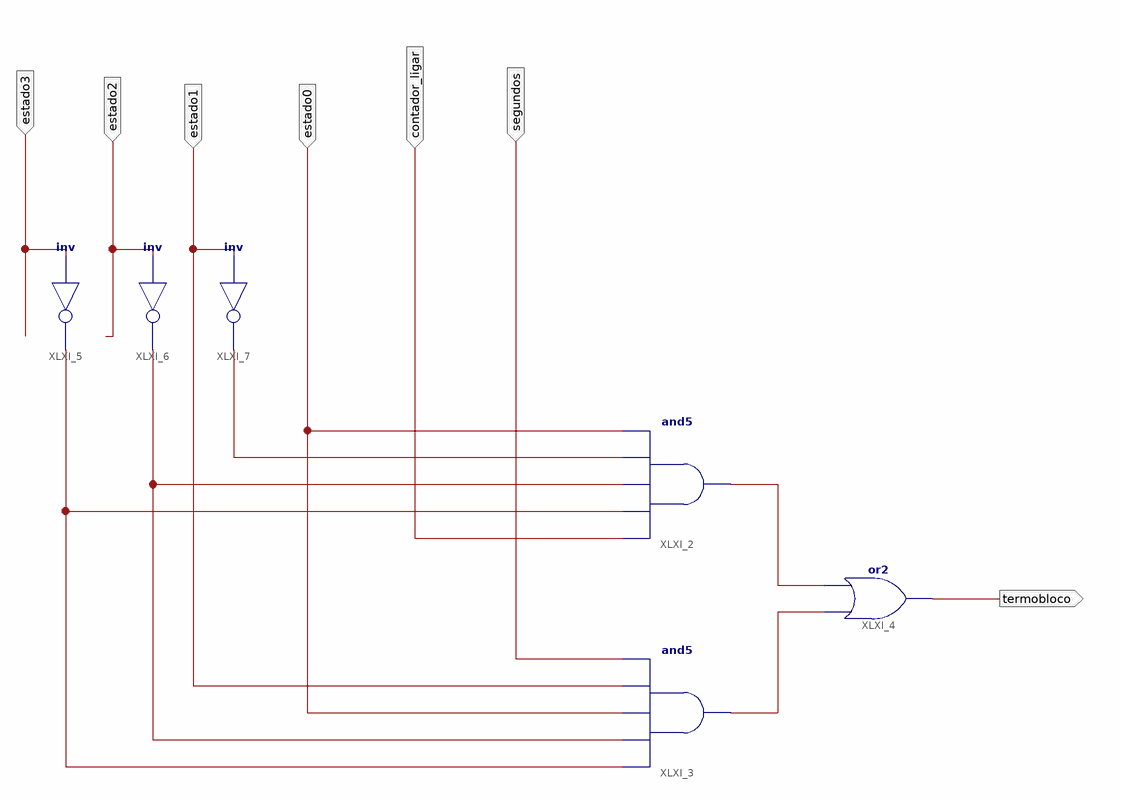
[diagram p0: schematic sheet 1]
// Xilinx ISE schematic termobloco.sch (spartan6) as structural Verilog: 6 symbols, 7 ports
module termobloco (
  input  segundos,
  input  estado2,
  input  estado3,
  input  estado1,
  input  contador_ligar,
  input  estado0,
  output termobloco
);

  wire XLXN_10, XLXN_11, XLXN_14, XLXN_15, XLXN_16;

  and XLXI_2 (XLXN_10, contador_ligar, XLXN_16, XLXN_15, XLXN_14, estado0);
  and XLXI_3 (XLXN_11, XLXN_16, XLXN_15, estado0, estado1, segundos);
  or XLXI_4 (termobloco, XLXN_11, XLXN_10);
  not XLXI_5 (XLXN_16, estado3);
  not XLXI_6 (XLXN_15, estado2);
  not XLXI_7 (XLXN_14, estado1);
endmodule
